# EAGLE design raspiboard (EAGLE 9.3.2)
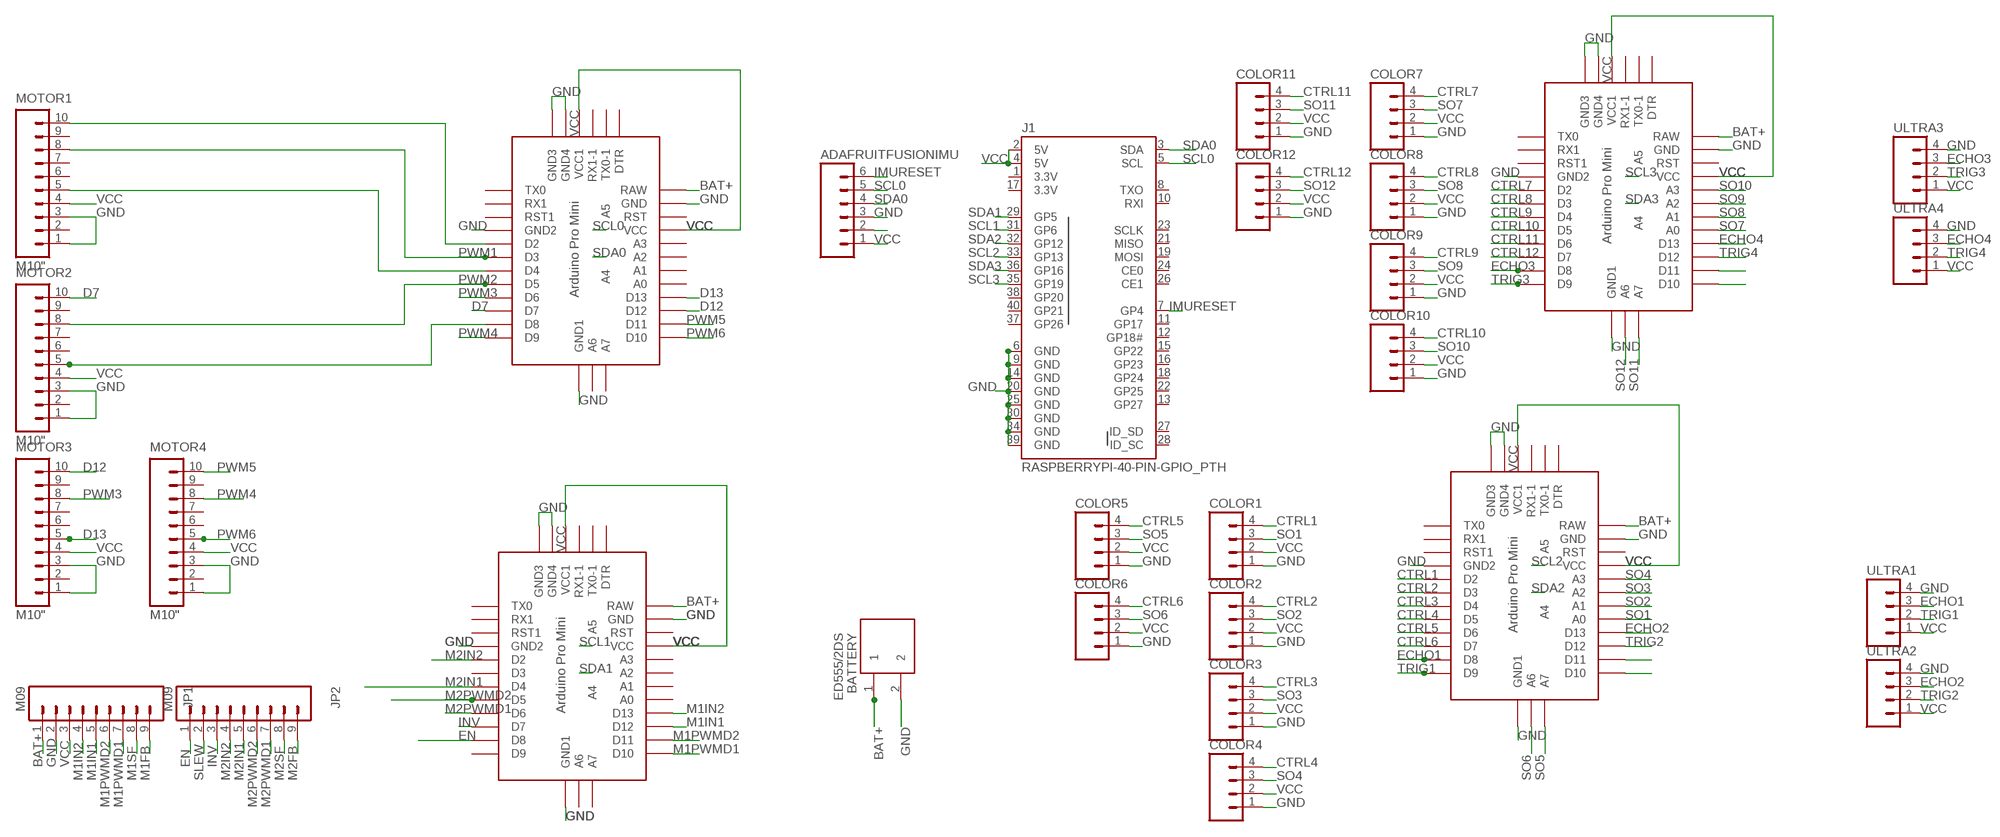
[diagram p0: schematic, sheet 1]

## Parts
ADAFRUITFUSIONIMU  M06SIP  [1X06]
BATTERY  ED555/2DS  [ED555/2DS]
COLOR1  M04PTH  [1X04]
COLOR2  M04PTH  [1X04]
COLOR3  M04PTH  [1X04]
COLOR4  M04PTH  [1X04]
COLOR5  M04PTH  [1X04]
COLOR6  M04PTH  [1X04]
COLOR7  M04PTH  [1X04]
COLOR8  M04PTH  [1X04]
COLOR9  M04PTH  [1X04]
COLOR10  M04PTH  [1X04]
COLOR11  M04PTH  [1X04]
COLOR12  M04PTH  [1X04]
J1  RASPBERRYPI-40-PIN-GPIO_PTH  [2X20_SHROUDED]
JP1  M09  [1X09]
JP2  M09  [1X09]
MOTOR1  M10"  [1X10]
MOTOR2  M10"  [1X10]
MOTOR3  M10"  [1X10]
MOTOR4  M10"  [1X10]
U$1  ABK-PRO-MINI  [ABK-PRO-MINI]
U$3  ABK-PRO-MINI  [ABK-PRO-MINI]
U$4  ABK-PRO-MINI  [ABK-PRO-MINI]
U$5  ABK-PRO-MINI  [ABK-PRO-MINI]
ULTRA1  M04PTH  [1X04]
ULTRA2  M04PTH  [1X04]
ULTRA3  M04PTH  [1X04]
ULTRA4  M04PTH  [1X04]

## Nets
BAT+: BATTERY.1 JP1.1 U$1.RAW U$3.RAW U$4.RAW U$5.RAW
CTRL1: COLOR1.4 U$3.D2
CTRL2: COLOR2.4 U$3.D3
CTRL3: COLOR3.4 U$3.D4
CTRL4: COLOR4.4 U$3.D5
CTRL5: COLOR5.4 U$3.D6
CTRL6: COLOR6.4 U$3.D7
CTRL7: COLOR7.4 U$5.D2
CTRL8: COLOR8.4 U$5.D3
CTRL9: COLOR9.4 U$5.D4
CTRL10: COLOR10.4 U$5.D5
CTRL11: COLOR11.4 U$5.D6
CTRL12: COLOR12.4 U$5.D7
D7: MOTOR2.10 U$1.D7
D12: MOTOR3.10 U$1.D12
D13: MOTOR3.5 U$1.D13
ECHO1: U$3.D8 ULTRA1.3
ECHO2: U$3.D13 ULTRA2.3
ECHO3: U$5.D8 ULTRA3.3
ECHO4: U$5.D13 ULTRA4.3
EN: JP2.1 U$4.D8
GND: ADAFRUITFUSIONIMU.3 BATTERY.2 COLOR1.1 COLOR2.1 COLOR3.1 COLOR4.1 COLOR5.1 COLOR6.1 COLOR7.1 COLOR8.1 COLOR9.1 COLOR10.1 COLOR11.1 COLOR12.1 J1.6(GND) J1.9(GND) J1.14(GND) J1.20(GND) J1.25(GND) J1.30(GND) J1.34(GND) J1.39(GND) JP1.2 MOTOR1.1 MOTOR1.3 MOTOR2.1 MOTOR2.3 MOTOR3.1 MOTOR3.3 MOTOR4.1 MOTOR4.3 U$1.GND U$1.GND1(GND2) U$1.GND2(GND3) U$1.GND3(GND4) U$1.GND4(GND1) U$3.GND U$3.GND1(GND2) U$3.GND2(GND3) U$3.GND3(GND4) U$3.GND4(GND1) U$4.GND U$4.GND1(GND2) U$4.GND2(GND3) U$4.GND3(GND4) U$4.GND4(GND1) U$5.GND U$5.GND1(GND2) U$5.GND2(GND3) U$5.GND3(GND4) U$5.GND4(GND1) ULTRA1.4 ULTRA2.4 ULTRA3.4 ULTRA4.4
IMURESET: ADAFRUITFUSIONIMU.6 J1.7(GP4)
INV: JP2.3 U$4.D7
M1FB: JP1.9
M1IN1: JP1.5 U$4.D12
M1IN2: JP1.4 U$4.D13
M1PWMD1: JP1.7 U$4.D10
M1PWMD2: JP1.6 U$4.D11
M1SF: JP1.8
M2FB: JP2.9
M2IN1: JP2.5 U$4.D4
M2IN2: JP2.4 U$4.D2
M2PWMD1: JP2.7 U$4.D6
M2PWMD2: JP2.6 U$4.D5
M2SF: JP2.8
N$2: MOTOR1.10 U$1.D2
N$3: MOTOR1.5 U$1.D4
N$4: MOTOR2.5 U$1.D8
N$6: U$5.D11
N$7: U$5.D10
N$8: ADAFRUITFUSIONIMU.2
N$13: U$3.D11
N$14: U$3.D10
PWM1: MOTOR1.8 U$1.D3
PWM2: MOTOR2.8 U$1.D5
PWM3: MOTOR3.8 U$1.D6
PWM4: MOTOR4.8 U$1.D9
PWM5: MOTOR4.10 U$1.D11
PWM6: MOTOR4.5 U$1.D10
SCL0: ADAFRUITFUSIONIMU.5 J1.5(SCL) U$1.A5
SCL1: J1.31(GP6) U$4.A5
SCL2: J1.33(GP13) U$3.A5
SCL3: J1.35(GP19) U$5.A5
SDA0: ADAFRUITFUSIONIMU.4 J1.3(SDA) U$1.A4
SDA1: J1.29(GP5) U$4.A4
SDA2: J1.32(GP12) U$3.A4
SDA3: J1.36(GP16) U$5.A4
SLEW: JP2.2
SO1: COLOR1.3 U$3.A0
SO2: COLOR2.3 U$3.A1
SO3: COLOR3.3 U$3.A2
SO4: COLOR4.3 U$3.A3
SO5: COLOR5.3 U$3.A7
SO6: COLOR6.3 U$3.A6
SO7: COLOR7.3 U$5.A0
SO8: COLOR8.3 U$5.A1
SO9: COLOR9.3 U$5.A2
SO10: COLOR10.3 U$5.A3
SO11: COLOR11.3 U$5.A7
SO12: COLOR12.3 U$5.A6
TRIG1: U$3.D9 ULTRA1.2
TRIG2: U$3.D12 ULTRA2.2
TRIG3: U$5.D9 ULTRA3.2
TRIG4: U$5.D12 ULTRA4.2
VCC: ADAFRUITFUSIONIMU.1 COLOR1.2 COLOR2.2 COLOR3.2 COLOR4.2 COLOR5.2 COLOR6.2 COLOR7.2 COLOR8.2 COLOR9.2 COLOR10.2 COLOR11.2 COLOR12.2 J1.2(5V) J1.4(5V) JP1.3 MOTOR1.4 MOTOR2.4 MOTOR3.4 MOTOR4.4 U$1.VCC U$1.VCC1 U$3.VCC U$3.VCC1 U$4.VCC U$4.VCC1 U$5.VCC U$5.VCC1 ULTRA1.1 ULTRA2.1 ULTRA3.1 ULTRA4.1
Unconnected: J1.8(TXO) J1.10(RXI) J1.11(GP17) J1.12(GP18#) J1.13(GP27) J1.15(GP22) J1.16(GP23) J1.18(GP24) J1.19(MOSI) J1.21(MISO) J1.22(GP25) J1.23(SCLK) J1.24(CE0) J1.26(CE1) J1.27(ID_SD) J1.28(ID_SC) J1.37(GP26) J1.38(GP20) J1.40(GP21) MOTOR1.2 MOTOR1.6 MOTOR1.7 MOTOR1.9 MOTOR2.2 MOTOR2.6 MOTOR2.7 MOTOR2.9 MOTOR3.2 MOTOR3.6 MOTOR3.7 MOTOR3.9 MOTOR4.2 MOTOR4.6 MOTOR4.7 MOTOR4.9 U$1.A0 U$1.A1 U$1.A2 U$1.A3 U$1.A6 U$1.A7 U$1.DTR U$1.RST U$1.RST1 U$1.RX1 U$1.RX1-1 U$1.TX0 U$1.TX0-1 U$3.DTR U$3.RST U$3.RST1 U$3.RX1 U$3.RX1-1 U$3.TX0 U$3.TX0-1 U$4.A0 U$4.A1 U$4.A2 U$4.A3 U$4.A6 U$4.A7 U$4.D3 U$4.D9 U$4.DTR U$4.RST U$4.RST1 U$4.RX1 U$4.RX1-1 U$4.TX0 U$4.TX0-1 U$5.DTR U$5.RST U$5.RST1 U$5.RX1 U$5.RX1-1 U$5.TX0 U$5.TX0-1

## Power pins joined to a net without a drawn wire
3.3V: J1.1(3.3V) J1.17(3.3V)

## Library data of the parts
ADAFRUITFUSIONIMU = SparkFun:M06: Header 6 Standard 6-pin 0.1" header. Use with straight break away headers (SKU : PRT-00116), right angle break away headers (PRT-00553), swiss pins (PRT-00743), machine pins (PRT-00117), and female headers (PRT-00115). Molex polarized connector foot print use with SKU : PRT-08094 with associated crimp pins and housings. NOTES ON THE VARIANTS LOCK and LOCK_LONGPADS... This footprint was designed to help hold the alignment of a through-hole component (i.e. 6-pin header) while soldering it into place. You may notice that each hole has been shifted either up or down by 0.005 of an inch from it's more standard position (which is a perfectly straight line). This slight alteration caused the pins (the squares in the middle) to touch the edges of the holes. Because they are alternating, it causes a "brace" to hold the component in place. 0.005 has proven to be the perfect amount of "off-center" position when using our standard breakaway headers. Although looks a little odd when you look at the bare footprint, once you have a header in there, the alteration is very hard to notice. Also, if you push a header all the way into place, it is covered up entirely on the bottom side. This idea of altering the position of holes to aid alignment will be further integrated into the Sparkfun Library for other footprints. It can help hold any component with 3 or more connection pins.
BATTERY = DC_LOAD_AU:ED555/2DS: 2-Pin Terminal Block 3.5mm pitch 6A
COLOR1-COLOR12 ULTRA1-ULTRA4 = SparkFun:M04: Header 4 Standard 4-pin 0.1" header. Use with straight break away headers (SKU : PRT-00116), right angle break away headers (PRT-00553), swiss pins (PRT-00743), machine pins (PRT-00117), and female headers (PRT-00115). Molex polarized connector foot print use with SKU : PRT-08231 with associated crimp pins and housings.
J1 = SparkFun-Connectors:RASPBERRYPI-40-PIN-GPIO: Raspberry Pi GPIO Header 2x20 pin connector, as found on B, B+, A+ models. Both shrouded PTH and SMT versions available. SparkFun Products: GPIO Shrouded Header <https://www.sparkfun.com/products/13054>- PTH SparkFun Pi Wedge (Preassembled) <https://www.sparkfun.com/products/13717>; PROD_ID: CONN-12263; SF_ID: PRT-13054
JP1 JP2 = SparkFun:M09: Header 9 Standard 9-pin 0.1" header. Use with straight break away headers (SKU : PRT-00116), right angle break away headers (PRT-00553), swiss pins (PRT-00743), machine pins (PRT-00117), and female headers (PRT-00115).
MOTOR1-MOTOR4 = SparkFun:M10: Header 10 Standard 10-pin 0.1" header. Use with straight break away headers (SKU : PRT-00116), right angle break away headers (PRT-00553), swiss pins (PRT-00743), machine pins (PRT-00117), and female headers (PRT-00115).
U$1 U$3-U$5 = Arduino-clone:ABK-PRO-MINI: ABK Pro-Mini Arduino Clone

## Board
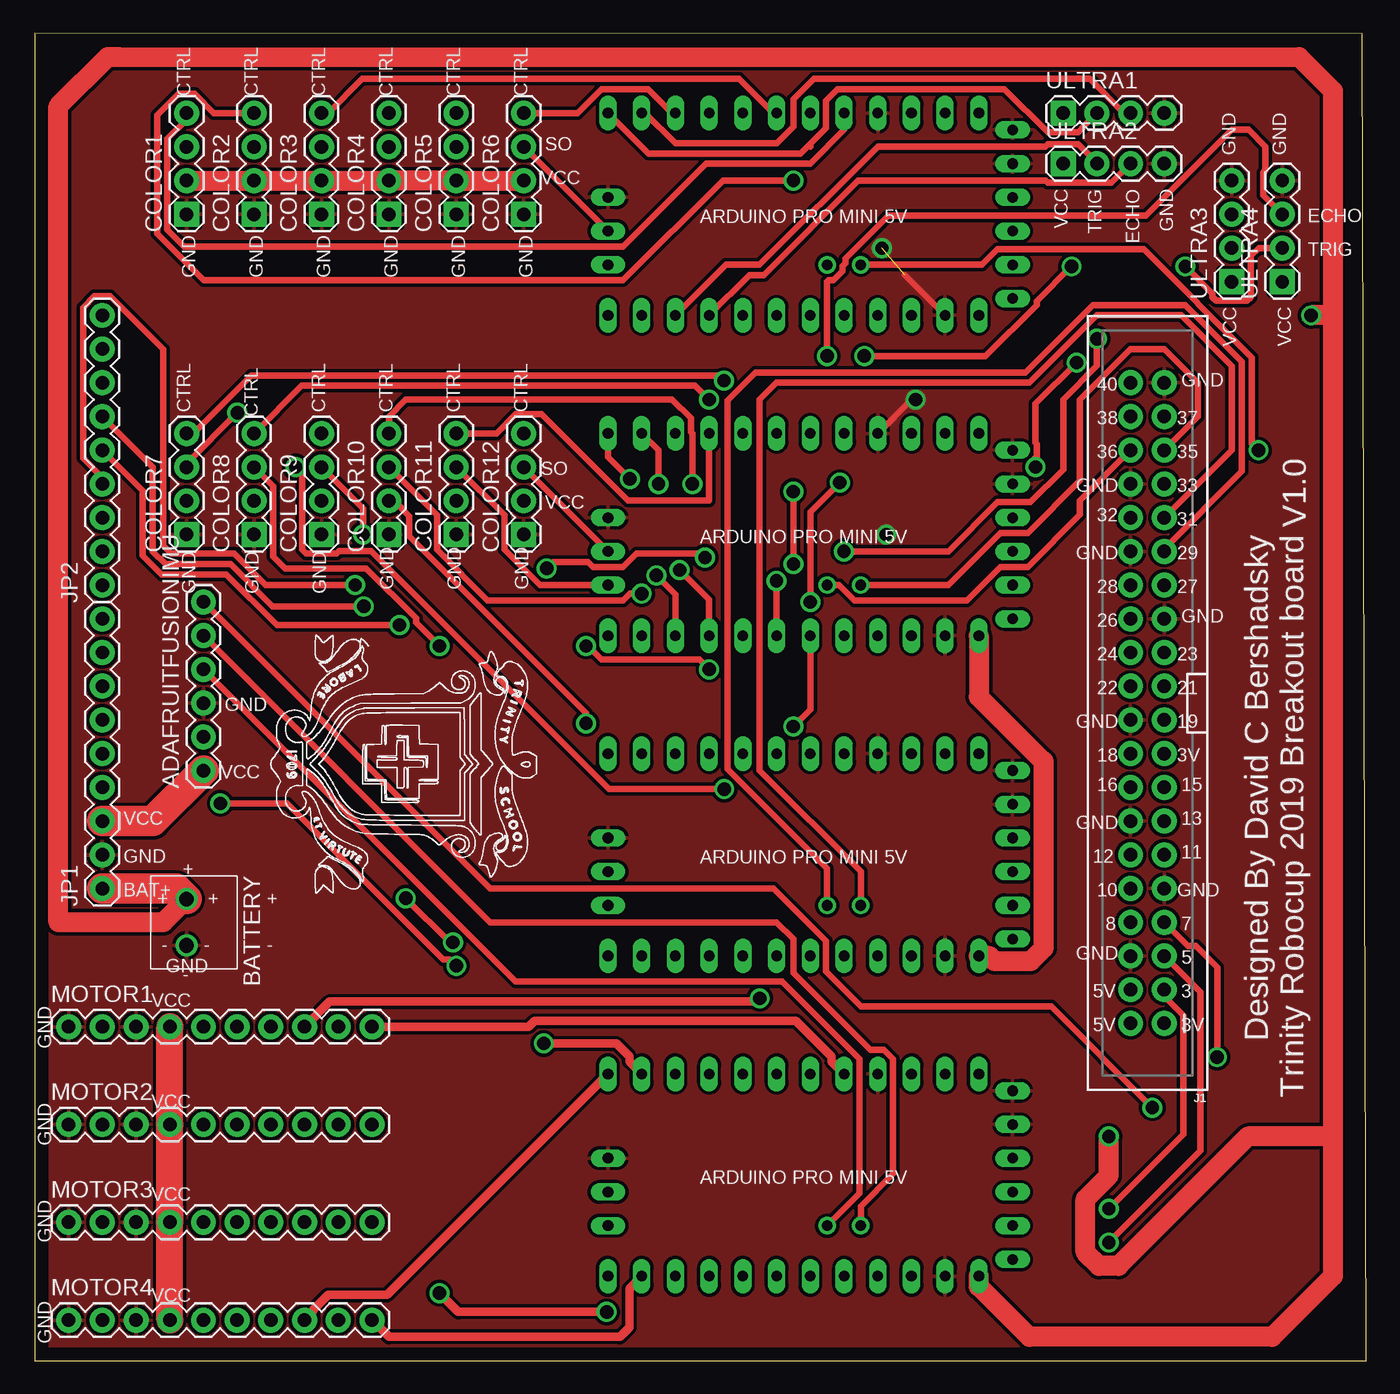
[diagram p1: board, top side]
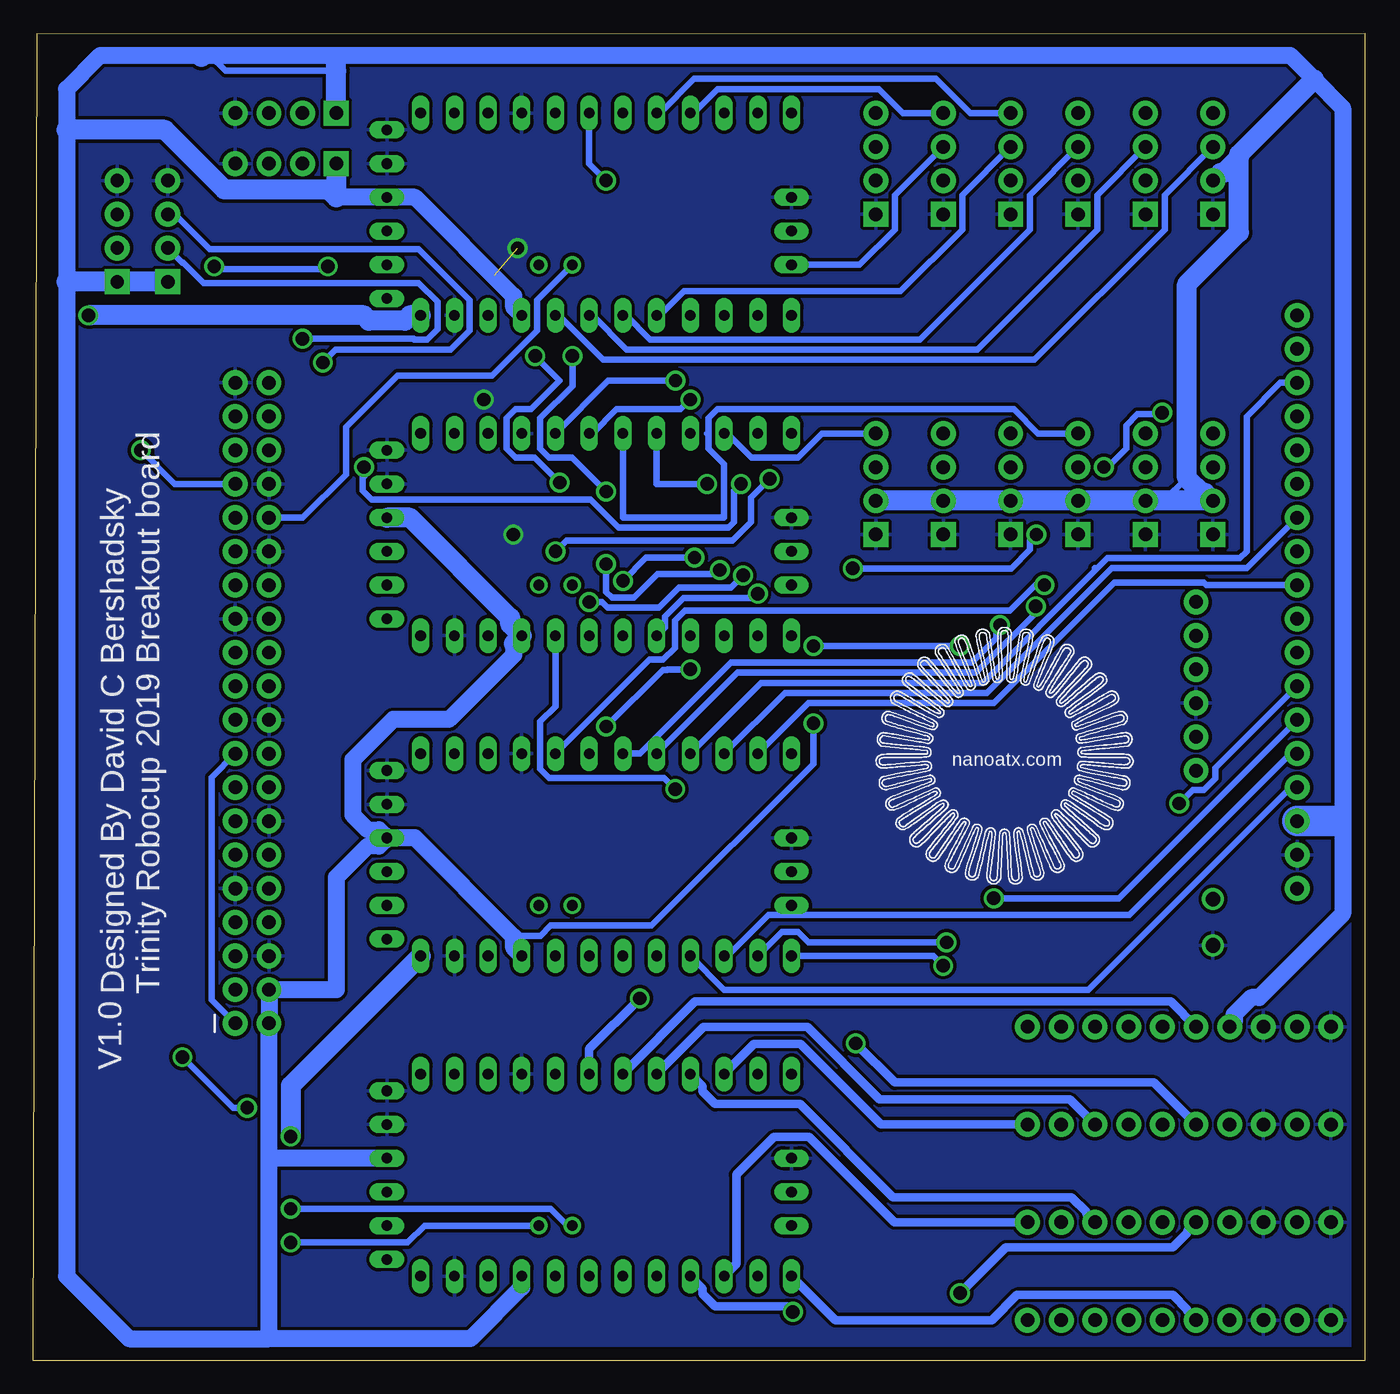
[diagram p2: board, bottom side, seen from below]

Size 100.31 x 100 mm. Coordinates in mm from the lower left corner, seen from the top.
Outline: 0,0 100.31,0 100,99.97 0,100 0,0
Copper layers (1*16): Top 0.035mm / dielectric 1.5mm / Bottom 0.035mm
Design rules "default *": minimum track width 20mil, minimum drill 1mm, track to track 10mil, track to pad 10mil, pad to pad 10mil, via to via 10mil, smd to smd 6mil, copper to edge 40mil, drill to drill 6mil, minimum pad ring 10mil, minimum via ring 8mil, stop-mask expansion 4mil, vias tented up to drill 0mil, thermal gap 10mil

### Footprints (pad centres in the part's own frame; a part is rotated, then mirrored left to right if it is on the bottom)
1X06 = drill 1.016 pad 1.88: 1 0,0; 2 2.54,0; 3 5.08,0; 4 7.62,0; 5 10.16,0; 6 12.7,0
ED555/2DS = drill 1.1: 1 -1.75,0; 2 1.75,0
1X04 = drill 1.016 pad 1.88 square: 1 0,0 | drill 1.016 pad 1.88: 2 2.54,0; 3 5.08,0; 4 7.62,0
2X20_SHROUDED = drill 1.016 pad 1.88: 1 -1.27,24.13; 2 1.27,24.13; 3 -1.27,21.59; 4 1.27,21.59; 5 -1.27,19.05; 6 1.27,19.05; 7 -1.27,16.51; 8 1.27,16.51; 9 -1.27,13.97; 10 1.27,13.97; 11 -1.27,11.43; 12 1.27,11.43; 13 -1.27,8.89; 14 1.27,8.89; 15 -1.27,6.35; 16 1.27,6.35; 17 -1.27,3.81; 18 1.27,3.81; 19 -1.27,1.27; 20 1.27,1.27; 21 -1.27,-1.27; 22 1.27,-1.27; 23 -1.27,-3.81; 24 1.27,-3.81; 25 -1.27,-6.35; 26 1.27,-6.35; 27 -1.27,-8.89; 28 1.27,-8.89; 29 -1.27,-11.43; 30 1.27,-11.43; 31 -1.27,-13.97; 32 1.27,-13.97; 33 -1.27,-16.51; 34 1.27,-16.51; 35 -1.27,-19.05; 36 1.27,-19.05; 37 -1.27,-21.59; 38 1.27,-21.59; 39 -1.27,-24.13; 40 1.27,-24.13
1X09 = drill 1.016 pad 1.88: 1 0,0; 2 2.54,0; 3 5.08,0; 4 7.62,0; 5 10.16,0; 6 12.7,0; 7 15.24,0; 8 17.78,0; 9 20.32,0
1X10 = drill 1.016 pad 1.88: 1 0,0; 2 2.54,0; 3 5.08,0; 4 7.62,0; 5 10.16,0; 6 12.7,0; 7 15.24,0; 8 17.78,0; 9 20.32,0; 10 22.86,0
ABK-PRO-MINI = drill 0.8 long: A0 10.16,-3.81; A1 10.16,-6.35; A2 10.16,-8.89; A3 10.16,-11.43; A6 3.81,-21.59; A7 6.35,-21.59; D2 -5.08,-3.81; D3 -5.08,-6.35; D4 -5.08,-8.89; D5 -5.08,-11.43; D6 -5.08,-13.97; D7 -5.08,-16.51; D8 -5.08,-19.05; D9 -5.08,-21.59; D10 10.16,-21.59; D11 10.16,-19.05; D12 10.16,-16.51; D13 10.16,-13.97; DTR 8.89,8.89; GND 10.16,3.81; GND1 -5.08,-1.27; GND2 -3.81,8.89; GND3 -1.27,8.89; GND4 1.27,-21.59; RAW 10.16,6.35; RST 10.16,1.27; RST1 -5.08,1.27; RX1 -5.08,3.81; RX1-1 3.81,8.89; TX0 -5.08,6.35; TX0-1 6.35,8.89; VCC 10.16,-1.27; VCC1 1.27,8.89 | drill 0.8: A4 6.35,-5.08; A5 6.35,-2.54

### Placement (x,y rotation side)
ADAFRUITFUSIONIMU  12.7,44.45 90 top
BATTERY  11.43,33.02 270 top
COLOR1  11.43,86.36 90 top
COLOR2  16.51,86.36 90 top
COLOR3  21.59,86.36 90 top
COLOR4  26.67,86.36 90 top
COLOR5  31.75,86.36 90 top
COLOR6  36.83,86.36 90 top
COLOR7  11.43,62.23 90 top
COLOR8  16.51,62.23 90 top
COLOR9  21.59,62.23 90 top
COLOR10  26.67,62.23 90 top
COLOR11  31.75,62.23 90 top
COLOR12  36.83,62.23 90 top
J1  83.82,49.53 180 top
JP1  5.08,35.56 90 top
JP2  5.08,58.42 90 top
MOTOR1  2.54,25.15 0 top
MOTOR2  2.54,17.78 0 top
MOTOR3  2.54,10.41 0 top
MOTOR4  2.54,3.05 0 top
U$1  64.77,16.51 270 top
U$3  64.77,88.9 270 top
U$4  64.77,40.64 270 top
U$5  64.77,64.77 270 top
ULTRA1  77.47,93.98 0 top
ULTRA2  77.47,90.17 0 top
ULTRA3  90.17,81.28 90 top
ULTRA4  93.98,81.28 90 top

### Tracks (layer width: path | path; a pad name or v marks a point on that pad's centre or on a via)
3.3V
  Bottom 0.508: J1.17 86.87,43.94 86.87,27.18 J1.1
BAT+  (via drill 1 pad 0.55)
  Top 1.524: BATTERY.1 9.68,33.02 1.78,33.02 1.78,94.49 5.51,98.22 6.35,98.22 95.25,98.2 97.79,95.66 97.79,78.74 | U$1.RAW 71.12,5.59 74.93,1.78 93.22,1.78 97.79,6.35 97.79,16.51 | 97.79,78.74 97.79,16.51 | 97.79,16.51 97.42,16.88 91.4,16.88 81.64,7.12 80.18,7.12 79.14,8.16 79.14,12.16 80.91,13.93 v80.91,16.88 | U$4.RAW 71.91,30.48 72.31,30.08 75.01,30.08 75.98,31.06 75.98,45.14 71.12,50.01 U$5.RAW | 97.79,78.74 v96.15,78.74
  Top 2.286: JP1.1 10.64,35.56 BATTERY.1
  Bottom 0.508: 96.01,78.74 96.01,78.87 v96.15,78.74 | v80.91,16.88 81.15,16.76 v80.9,16.89
  Bottom 1.524: U$4.RAW 80.9,20.7 v80.9,16.89 | U$3.RAW 71.91,78.74 72.31,78.34 75.01,78.34 75.41,78.74 96.01,78.74 96.14,78.74
CTRL1
  Top 0.508: U$3.D2 60.96,92.71 58.42,90.17 50.56,90.17 44.31,83.93 11.26,83.93 9.98,85.21 9.98,92.04 11.43,93.49 COLOR1.4
CTRL2  (via drill 1 pad 0.55)
  Top 0.508: v57.15,88.9 51.83,88.9 44.31,81.39 12.73,81.39 9.22,84.89 9.22,93.82 10.83,95.43 12.03,95.43 13.48,93.98 COLOR2.4
  Bottom 0.508: v57.15,88.9 58.42,90.17 U$3.D3
CTRL3
  Top 0.508: COLOR3.4 22.08,93.98 24.66,96.56 53.06,96.56 55.64,93.98 U$3.D4
CTRL4
  Bottom 0.508: COLOR4.4 29.7,93.98 32.28,96.56 50.52,96.56 53.1,93.98 U$3.D5
CTRL5
  Bottom 0.508: COLOR5.4 34.78,93.98 36.6,95.8 48.74,95.8 50.56,93.98 U$3.D6
CTRL6
  Top 0.508: COLOR6.4 40.88,93.98 42.7,95.8 46.2,95.8 48.02,93.98 U$3.D7
CTRL7  (via drill 1 pad 0.55)
  Top 0.508: COLOR7.4 11.92,69.85 16.28,74.21 51.52,74.21 v51.91,73.82
  Bottom 0.508: v51.91,73.82 56.99,73.82 U$5.D2
CTRL8  (via drill 1 pad 0.55)
  Top 0.508: v50.8,72.39 49.75,73.44 20.1,73.44 COLOR8.4
  Bottom 0.508: v50.8,72.39 51.52,71.67 56.36,71.67 58.18,69.85 U$5.D3
CTRL9
  Bottom 0.508: COLOR9.4 24.62,69.85 26.44,71.67 48.74,71.67 49.42,70.98 49.42,69.96 | 49.42,69.96 49.53,69.85 | U$5.D4 55.88,63.5 48.26,63.5 48.26,67.55 49.42,68.72 49.42,69.96
CTRL10  (via drill 1 pad 0.55)
  Top 0.508: COLOR10.4 26.67,71.12 27.94,72.39 48.02,72.39 49.42,70.98 49.42,69.96 49.53,69.85 v49.53,66.04
  Bottom 0.508: v49.53,66.04 53.34,66.04 U$5.D5
CTRL11
  Top 0.508: COLOR11.4 34.78,69.85 36.23,71.3 38.16,71.3 44.69,64.77 50.8,64.77 U$5.D6
CTRL12
  Bottom 0.508: COLOR12.4 40.88,69.85 42.7,68.03 46.2,68.03 48.02,69.85 U$5.D7
D7
  Bottom 0.635: MOTOR2.10 36.44,17.78 42.52,23.85 46,23.85 U$1.D7
D12
  Bottom 0.635: U$1.D12 47.33,7.28 47.33,14.02 44.5,16.85 41.86,16.85 35.43,10.41 MOTOR3.10
D13  (via drill 1 pad 0.55)
  Top 0.635: v43.08,3.66 31.9,3.66 v30.48,5.08
  Bottom 0.635: v43.08,3.66 43.52,4.09 48.92,4.09 49.87,5.03 49.87,5.42 U$1.D13 | v30.48,5.08 27.04,8.52 14.46,8.52 13.35,9.63 13.35,9.77 MOTOR3.5
ECHO1
  Top 0.508: U$3.D8 45.96,93.98 48.25,91.69 55.89,91.69 57.15,92.95 57.15,95.01 58.7,96.56 79.48,96.56 82.06,93.98 ULTRA1.3
ECHO2
  Top 0.508: U$3.D13 53.85,81.79 54.93,81.79 62.01,88.87 76.17,88.87 76.32,88.72 81.1,88.72 ULTRA2.3
ECHO3  (via drill 1 pad 0.55)
  Top 0.508: U$5.D8 46.99,68.58 v46.99,66.04 | v78.48,75.19 75.39,72.09 75.39,69.15 75.48,69.06 75.48,68.1 75.39,68.01 v75.39,67.31
  Bottom 0.508: v46.99,66.04 47.5,65.53 47.5,63.18 47.94,62.74 56.2,62.74 58.34,64.88 74.8,64.88 75.48,65.56 75.48,66.52 75.39,66.61 v75.39,67.31 | ULTRA3.3 89.66,86.36 87.01,83.71 71.25,83.71 67.42,79.88 67.42,77.61 68.86,76.16 77.51,76.16 v78.48,75.19
ECHO4  (via drill 1 pad 0.55)
  Top 0.508: ULTRA4.3 92.53,87.81 92.53,89.5 92.71,89.68 92.71,91.44 91.44,92.71 90.17,92.71 83.71,86.25 64.29,86.25 61.07,83.03 61.07,82.66 60.85,82.44 60.85,82.07 60.17,81.39 59.8,81.39 59.69,81.28 v59.69,75.68 | v57.14,65.46 57.14,60.02 v57.15,60.01 | v48.58,59.55 50.8,57.33 U$5.D13
  Bottom 0.508: v59.69,75.68 59.69,73.42 62.12,70.98 62.12,68.72 61.44,68.03 59.71,68.03 v57.14,65.46 | v48.58,59.55 48.9,59.23 53.29,59.23 55.04,57.48 56.72,57.48 57.14,57.9 57.14,59.99 v57.15,60.01
EN
  Bottom 0.508: JP2.1 11.92,58.42 12.1,58.6 18.87,58.6 27.94,49.53 41.91,49.53 U$4.D8
GND  (via drill 1 pad 0.55)  (1 unrouted)
  Top 0.508: U$5.GND1 66.05,72.4 v66.36,72.4 | U$3.GND 65.53,81.79 | 21.59,62.87 COLOR9.1
  Bottom 0.508: U$5.GND1 63.5,68.8
  other vias: 64.14,62.23 63.82,83.81
  pour Top: 0.25,99.82 100.33,99.82 100.33,-0.25 0.25,-0.25
  pour Bottom: 0.25,99.82 100.33,99.82 100.33,-0.25 0.25,-0.25
IMURESET  (via drill 1 pad 0.55)
  Top 0.508: J1.7 86.87,31.24 87.45,31.24 89.07,29.63 v89.07,22.86 | v84.19,19.05 76.57,26.67 62.23,26.67 59.58,29.32 59.58,31.61 55.64,35.56 34.29,35.56 ADAFRUITFUSIONIMU.6
  Bottom 0.508: v89.07,22.86 85.26,19.05 v84.19,19.05
INV
  Bottom 0.508: JP2.3 8.89,59.69 19.05,59.69 28.45,50.29 43.69,50.29 U$4.D7
M1IN1
  Bottom 0.508: JP1.5 5.57,45.72 17.73,33.57 44.93,33.57 48.02,30.48 U$4.D12
M1IN2
  Bottom 0.508: JP1.4 5.57,43.18 20.81,27.94 48.26,27.94 U$4.D13
M1PWMD1  (via drill 1 pad 0.55)
  Top 0.508: v31.75,29.74 31.25,30.24 30.75,30.24 19.01,41.97 v13.97,41.97
  Bottom 0.508: U$4.D10 32.49,30.48 v31.75,29.74 | v13.97,41.97 12.94,43 12.1,43 11.25,43.85 11.25,44.63 JP1.7
M1PWMD2  (via drill 1 pad 0.55)
  Top 0.508: v27.94,34.82 31.27,31.5 v31.5,31.5
  Bottom 0.508: v31.5,31.5 41.9,31.5 42.7,32.3 43.9,32.3 U$4.D11 | JP1.6 18.52,34.82 v27.94,34.82
M2IN1  (via drill 1 pad 0.55)
  Top 0.508: 5.24,68.74 JP2.5 8.13,65.53 8.13,60.64 9.54,59.23 14.43,59.23 18.26,55.4 v27.46,55.4
  Bottom 0.508: U$4.D4 54.61,45.72 47.75,52.58 29.59,52.58 27.75,54.42 27.75,55.12 v27.46,55.4
M2IN2  (via drill 1 pad 0.55)
  Top 0.508: 5.33,66.3 JP2.4 5.08,66.53 3.63,67.98 3.63,79.34 4.48,80.19 5.68,80.19 9.65,76.22 9.65,61.41 10.28,60.78 15.03,60.78 17.39,58.42 v24.13,58.42
  Bottom 0.508: v24.13,58.42 24.82,58.42 26.73,56.52 51.19,56.52 51.96,55.74 51.96,53.69 52.86,52.79 53.89,52.79 U$4.D2
M2PWMD1
  Bottom 0.508: U$4.D6 45.47,51.05 28.76,51.05 20.32,59.5 | JP2.7 6.35,73.66 8.89,71.12 8.89,60.96 9.4,60.45 19.37,60.45 20.32,59.5 | 20.32,59.5 20.32,59.69
M2PWMD2  (via drill 1 pad 0.55)
  Top 0.508: 5.33,71.38 JP2.6 8.89,67.31 8.89,60.96 9.86,59.99 14.74,59.99 17.92,56.82 v24.78,56.82
  Bottom 0.508: U$4.D5 47.24,51.82 29.27,51.82 24.27,56.82 v24.78,56.82
N$2
  Top 0.635: MOTOR1.10 37.2,25.15 37.64,25.59 57.35,25.59 60.03,22.91 60.03,22.52 U$1.D2
N$3
  Bottom 0.635: MOTOR1.5 14.59,27.04 50.43,27.04 U$1.D4
N$4  (via drill 1 pad 0.55)
  Top 0.635: U$1.D8 44.79,22.52 44.79,22.91 43.81,23.89 v38.34,23.89
  Bottom 0.635: v38.34,23.89 35.4,20.94 15.86,20.94 MOTOR2.5
PWM1  (via drill 1 pad 0.55)
  Top 0.635: v54.61,27.29 54.36,27.04 22.21,27.04 MOTOR1.8
  Bottom 0.635: v54.61,27.29 58.42,23.48 U$1.D3
PWM2
  Bottom 0.635: MOTOR2.8 22.21,19.67 36.54,19.67 41.99,25.12 49.81,25.12 U$1.D5
PWM3
  Bottom 0.635: U$1.D6 49.87,20.66 49.87,20.27 48.92,19.33 42.55,19.33 35.52,12.31 22.08,12.31 20.97,11.2 20.97,11.06 MOTOR3.8
PWM4
  Top 0.635: MOTOR4.8 20.97,3.7 20.97,3.83 22.08,4.94 26.53,4.94 U$1.D9
PWM5
  Top 0.635: U$1.D11 44.79,5.42 44.79,2.49 44.07,1.78 26.67,1.78 MOTOR4.10
PWM6
  Bottom 0.635: U$1.D10 39.88,3.05 28.08,3.05 26.18,4.94 14.46,4.94 13.35,3.83 13.35,3.7 MOTOR4.5
SCL0  (via drill 1 pad 0.55)
  Top 0.508: v80.91,8.89 87.81,15.79 87.81,27.76 J1.5 | U$1.A5 62.23,11.62 64.66,14.05 64.66,22.73 63.98,23.41 62.95,23.41 57.15,29.21 57.15,31.75 55.88,33.02 34.29,33.02 ADAFRUITFUSIONIMU.5
  Bottom 0.508: v80.91,8.89 72.09,8.89 70.82,10.16 U$1.A5
SCL1
  Top 0.508: U$4.A5 62.23,36.83 54.61,44.45 54.61,72.39 55.88,73.66 74.93,73.66 80.01,78.74 86.36,78.74 90.17,74.93 90.17,68.58 J1.31
SCL2  (via drill 1 pad 0.55)
  Top 0.508: v92.19,68.58 91.69,69.08 91.69,75.56 83.54,83.71 72.53,83.71 71.36,82.55 U$3.A5
  Bottom 0.508: v92.19,68.58 89.65,66.04 J1.33
SCL3
  Top 0.508: U$5.A5 68.82,58.42 72.74,62.34 74.8,62.34 78.74,66.28 78.74,72.39 82.55,76.2 85.09,76.2 87.63,73.66 87.63,71.12 J1.35
SDA0  (via drill 1 pad 0.55)
  Top 0.508: J1.3 85.09,27.45 86.54,26 86.54,17.06 v80.91,11.43 | ADAFRUITFUSIONIMU.4 36.22,28.55 56.3,28.55 62.12,22.73 62.12,12.59 U$1.A4
  Bottom 0.508: U$1.A4 60.05,10.16 61.32,11.43 v80.91,11.43
SDA1
  Top 0.508: U$4.A4 59.69,37.07 52.18,44.59 52.18,72.31 54.29,74.42 74.61,74.42 79.69,79.5 86.68,79.5 90.93,75.25 90.93,66.99 85.09,61.15 J1.29
SDA2
  Bottom 0.508: J1.32 80.01,63.5 76.75,66.76 76.75,70.33 72.87,74.21 65.74,74.21 62.34,77.61 62.34,79.9 U$3.A4
SDA3
  Top 0.508: J1.36 78.74,64.77 78.74,63.74 74.8,59.8 72.74,59.8 70.2,57.26 61.75,57.26 60.59,58.42 U$5.A4
SO1
  Bottom 0.508: COLOR1.3 15.06,87.81 15.06,85.21 24.87,75.4 57.38,75.4 60.72,78.74 U$3.A0
SO2
  Bottom 0.508: COLOR2.3 20.14,87.81 20.14,85.21 29.19,76.16 55.6,76.16 58.18,78.74 U$3.A1
SO3
  Bottom 0.508: COLOR3.3 25.22,87.81 25.22,85.21 33.51,76.92 53.82,76.92 55.64,78.74 U$3.A2
SO4
  Bottom 0.508: COLOR4.3 30.3,87.81 30.3,85.21 34.96,80.56 51.28,80.56 53.1,78.74 U$3.A3
SO5
  Bottom 0.508: COLOR5.3 35.38,87.81 35.38,85.21 38.04,82.55 U$3.A7
SO6
  Top 0.508: COLOR6.3 U$3.A6
SO7  (via drill 1 pad 0.55)
  Top 0.508: COLOR7.3 11.43,67.58 v15.25,71.4 | v19.65,67.31 20.14,66.81 20.14,61.08 20.44,60.78 22.74,60.78 22.93,60.97 25.33,60.97 43.26,43.05 v51.94,43.05
  Bottom 0.508: v19.65,67.31 19.34,67.31 17.96,68.69 17.96,70.45 17.11,71.3 15.36,71.3 v15.25,71.4 | v51.94,43.05 52.79,43.9 61.44,43.9 62.12,44.59 62.12,48.12 60.96,49.29 U$5.A0
SO8  (via drill 1 pad 0.55)
  Top 0.508: v30.48,53.84 28.72,55.59 28.72,55.92 24.97,59.68 18.87,59.68 17.96,60.59 17.96,65.86 COLOR8.3 | v41.52,53.84 41.66,53.84 42.7,52.79 50.08,52.79 v50.8,52.07 | v57.14,47.76 58.42,49.05 U$5.A1
  Bottom 0.508: v30.48,53.84 v41.52,53.84 | v50.8,52.07 52.51,52.07 52.54,52.03 52.87,52.03 v57.14,47.76
SO9  (via drill 1 pad 0.55)
  Top 0.508: U$5.A2 v55.88,58.74 | v38.56,59.68 39.06,60.17 41.67,60.17 42.05,59.8 44.31,59.8 45.33,60.81 50.16,60.81 v50.48,60.49 | v24.73,62.23 24.73,64.17 COLOR9.3
  Bottom 0.508: v55.88,58.74 54.13,60.49 v50.48,60.49 | v24.73,62.23 25.22,61.73 25.22,61.08 26.62,59.68 v38.56,59.68
SO10  (via drill 1 pad 0.55)
  Top 0.508: COLOR10.3 30.3,63.68 30.3,61.08 34.12,57.26 44.31,57.26 44.83,57.77 v45.72,57.77
  Bottom 0.508: 53.34,55.24 U$5.A3 52.72,55.23 52.72,56.06 51.33,57.46 46.04,57.46 v45.72,57.77
SO11
  Top 0.508: COLOR11.3 35.38,63.68 35.38,61.08 38.04,58.42 U$5.A7
SO12
  Top 0.508: COLOR12.3 U$5.A6
TRIG1
  Top 0.508: ULTRA1.2 78.92,92.89 78.92,92.83 78.62,92.53 76.32,92.53 73.06,95.8 60.48,95.8 59.58,94.9 59.58,92.84 58.42,91.68 | 58.42,91.68 58.42,91.44 | 58.42,91.68 57.67,90.93 46.23,90.93 U$3.D9
TRIG2
  Top 0.508: ULTRA2.2 80.01,90.23 78.62,91.62 76.32,91.62 76.14,91.44 63.5,91.44 54.61,82.55 52.07,82.55 U$3.D12
TRIG3  (via drill 1 pad 0.55)
  Top 0.508: v80.02,76.97 80.02,74.94 77.47,72.39 77.47,67.12 75.01,64.66 72.53,64.66 68.82,60.96 v60.96,60.96 | v44.83,66.42 43.18,68.06 U$5.D9
  Bottom 0.508: ULTRA3.2 89.08,82.73 89.02,82.73 87.46,81.17 71.25,81.17 69.85,79.77 69.85,77.71 70.64,76.92 71.6,76.92 71.65,76.97 v80.02,76.97 | v60.96,60.96 60.13,61.78 47.63,61.78 46.23,63.18 46.23,65.01 v44.83,66.42
TRIG4  (via drill 1 pad 0.55)
  Top 0.508: ULTRA4.2 92.22,83.82 91.62,83.22 91.62,80.13 91.32,79.83 89.02,79.83 88.72,80.13 88.72,80.39 v86.68,82.43 | v78.11,82.43 75.48,79.8 75.48,79.53 71.63,75.68 v62.48,75.68 | v60.64,66.14 58.42,63.91 v58.42,57.15 | v46.82,59.15 48.26,57.71 U$5.D12
  Bottom 0.508: v86.68,82.43 86.48,82.23 78.3,82.23 v78.11,82.43 | v62.48,75.68 60.64,73.84 62.81,71.67 63.98,71.67 64.66,70.98 64.66,68.72 63.98,68.03 62.54,68.03 v60.64,66.14 | v58.42,57.15 57.47,57.15 57.03,56.72 53.15,56.72 51.65,58.22 47.76,58.22 v46.82,59.15
VCC  (via drill 1)
  Top 0.508: v41.53,48.01 41.53,48.77 28.19,62.1 28.19,63.63 27.05,64.77 COLOR10.2
  Top 1.524: COLOR1.2 COLOR2.2 COLOR3.2 COLOR4.2 COLOR5.2 COLOR6.2
  Top 2.032: MOTOR4.4 MOTOR3.4 | 10.16,11.43 MOTOR3.4 | MOTOR3.4 MOTOR2.4 MOTOR1.4
  Top 2.286: JP1.3 8.89,40.64 ADAFRUITFUSIONIMU.1
  Bottom 0.508: 13.39,66.5 15.12,64.77 COLOR8.2 | v41.53,48.01 41.53,44.96 53.72,32.77 61.34,32.77 62.1,32 63.63,32 64.12,31.93 | 87.63,98.2 87.63,98.42 87.63,98.32 | 77.47,97.16 85.83,97.16 87,98.32
  Bottom 1.27: 82.55,1.65 82.55,15.24 | 82.55,15.24 J1.2 J1.4 77.47,27.94 77.47,36.4 75.11,38.75 74.28,38.75 U$4.VCC1 | U$1.VCC1 82.55,15.24 | U$4.VCC 64.12,31.1 64.12,31.93 71.56,39.37 U$4.VCC1 | U$3.VCC 64.12,79.36 64.12,80.19 71.56,87.63 U$3.VCC1 77.47,87.63 | 82.55,1.65 93.09,1.65 97.79,6.35 97.79,81.28 97.79,92.71 97.79,95.78 95.25,98.32 87.63,98.32 87,98.32 5.61,98.32 3.81,96.52 1.65,94.36 1.65,40.64 | 82.55,1.65 67.36,1.65 63.5,5.51 U$1.VCC | 64.12,53.99 64.12,53.16 68.98,48.3 73.19,48.3 76.24,45.25 76.24,41.11 75.11,39.99 74.28,39.99 U$4.VCC1 | MOTOR1.4 9.83,25.48 9.83,26.06 8.54,27.36 7.95,27.36 1.65,33.66 1.65,40.64 | JP1.3 1.65,40.64
  Bottom 1.524: COLOR1.2 10.85,89.48 10.62,89.48 9.47,90.63 | 64.12,53.99 U$5.VCC 64.37,55.48 64.37,55.96 71.91,63.5 U$5.VCC1 | COLOR12.2 COLOR11.2 COLOR9.2 COLOR8.2 COLOR7.2 12.01,65.35 12.24,65.35 13.39,66.5 13.39,81.09 9.47,85 9.47,90.63 | 9.47,90.63 9.47,90.86 3.81,96.52 | ULTRA1.1 77.47,97.16 77.47,98.2 | 77.47,98.2 | ULTRA2.1 77.47,87.63 78.05,88.21 85.9,88.21 90.4,92.71 97.79,92.71 | ULTRA3.1 ULTRA4.1 97.79,81.28 | 87.63,98.2
  Bottom 2.286: JP1.3 2.16,40.64

### Text on the board
tNames: CTRL | CTRL | CTRL | CTRL | CTRL | CTRL | SO | GND | GND | VCC | VCC | TRIG | ECHO | GND | ARDUINO PRO MINI 5V | ECHO | GND | GND | GND | GND | GND | GND | TRIG | VCC | VCC | 40 | GND | CTRL | CTRL | CTRL | CTRL | CTRL | CTRL | 38 | 37 | 36 | 35 | V1.0 | SO | GND | 33 | VCC | ARDUINO PRO MINI 5V | 32 | 31 | Designed By David C Bershadsky / Trinity Robocup 2019 Breakout board | GND | GND | GND | GND | GND | GND | GND | 29 | 28 | 27 | GND | 26 | 24 | 23 | 22 | 21 | GND | GND | 19 | 18 | 3V | VCC | 16 | 15 | VCC | GND | 13 | ARDUINO PRO MINI 5V | 11 | GND | + | 12 | BAT+ | 10 | GND | + | + | + | 8 | - | - | - | GND | GND | - | VCC | 5V | 3 | 5V | 3V | GND | VCC | GND | ARDUINO PRO MINI 5V | VCC | GND | VCC | GND
bNames: nanoatx.com | Designed By David C Bershadsky / Trinity Robocup 2019 Breakout board | V1.0
_tNames: 7 | 5